# EAGLE design ModulatedIRSensor (EAGLE 6.5.0)
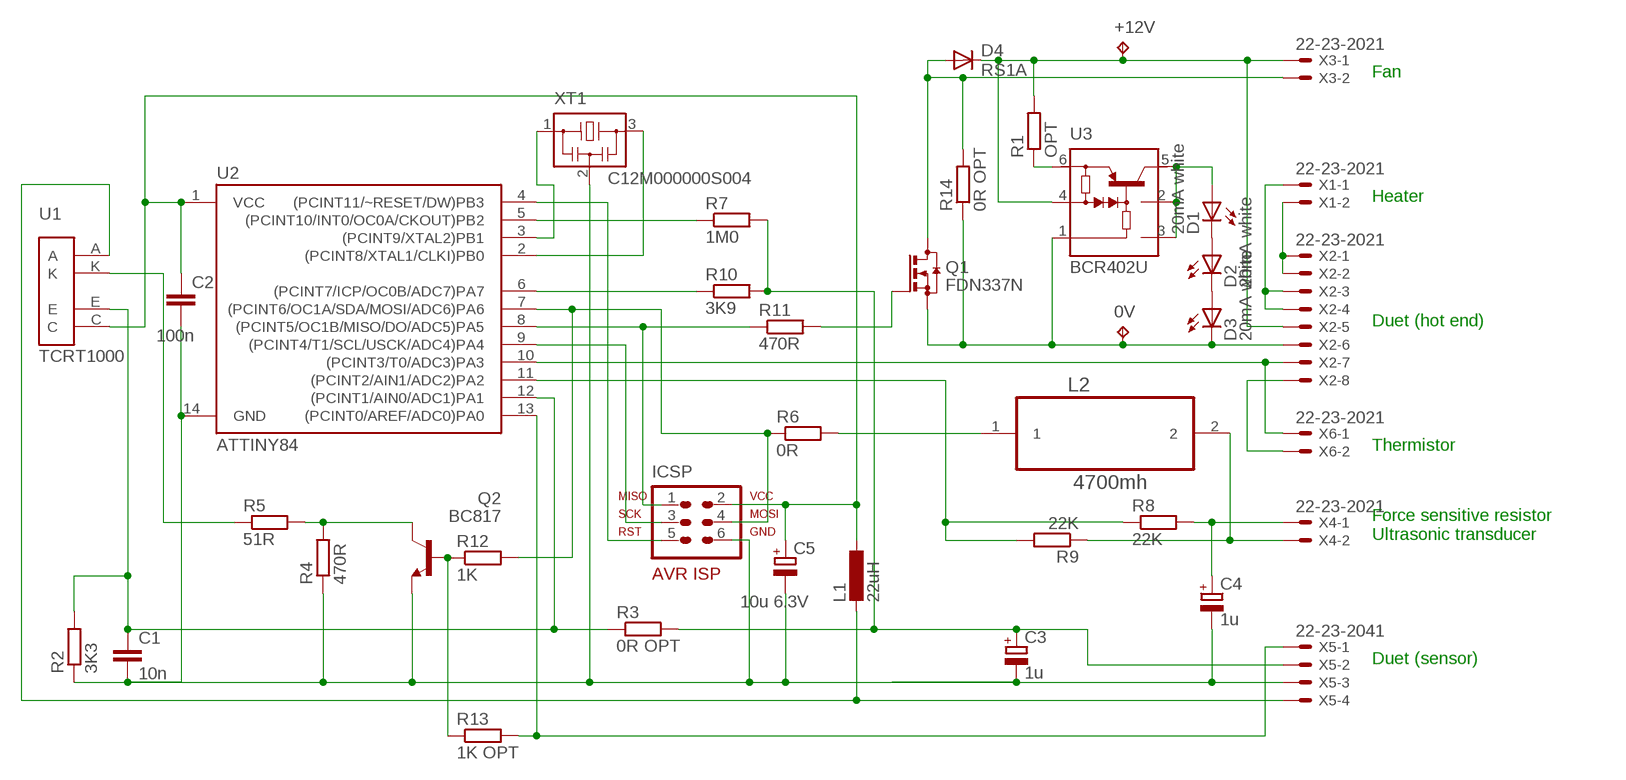
[diagram p0: schematic, sheet 1]

## Parts
0V  TPPAD1-13  [P1-13]
+12V  TPPAD1-13  [P1-13]
C1  10n  C-EUC0603  [C0603]
C2  100n  C-EUC0603  [C0603]
C3  1u  CPOL-EUSMCA  [SMC_A]
C4  1u  CPOL-EUSMCA  [SMC_A]
C5  10u 6.3V  CPOL-EUSMCA  [SMC_A]
D1  20mA white  LED5MM  [LED5MM]
D2  20mA white  LED5MM  [LED5MM]
D3  20mA white  LED5MM  [LED5MM]
D4  RS1A  DIODE-DO214AC  [DO214AC]
ICSP  AVR-ISP-6VERT  [AVR-ISP-6]
L1  22uH  L-EUL2012C  [L2012C]
L2  4700mh  B82442H1475K  [INDC5650X530N]
Q1  FDN337N  BSS123  [SOT23]
Q2  BC817  BC847  [SOT23]
R1  OPT  R-EU_R0603  [R0603]
R2  3K3  R-EU_R0603  [R0603]
R3  0R OPT  R-EU_R0603  [R0603]
R4  470R  R-EU_R0603  [R0603]
R5  51R  R-EU_R0603  [R0603]
R6  0R  R-EU_R0603  [R0603]
R7  1M0  R-EU_R0603  [R0603]
R8  22K  R-EU_R0603  [R0603]
R9  22K  R-EU_R0603  [R0603]
R10  3K9  R-EU_R0603  [R0603]
R11  470R  R-EU_R0603  [R0603]
R12  1K  R-EU_R0603  [R0603]
R13  1K OPT  R-EU_R0603  [R0603]
R14  0R OPT  R-EU_R0603  [R0603]
U1  TCRT1000  [TCRT1000]
U2  ATTINY84  [SO14]
U3  BCR402U  [SC74_INFINEON]
X1  22-23-2021  [22-23-2021]
X2  22-23-2021  22-23-2081  [22-23-2081]
X3  22-23-2021  [22-23-2021]
X4  22-23-2021  [22-23-2021]
X5  22-23-2041  [22-23-2041]
X6  22-23-2021  [22-23-2021]
XT1  C12M000000S004  CSTCR6M00G53Z  [CSTCR6M]

## Nets
GND: C1.2 C2.2 C3.- C4.- C5.- ICSP.6 Q2.2(E) R2.1 R4.1 U2.14(GND) X5.3 XT1.2
GND2: 0V.TP D3.K(C) Q1.2(S) R14.1 U3.1(GND) X2.6
LED: D1.A U3.2(IOUT2) U3.3(IOUT3) U3.5(IOUT1)
N$1: L1.2 U1.A X5.4
N$2: L2.2 R9.1 X4.2
N$3: ICSP.5 U2.4((PCINT11/~RESET/DW)PB3)
N$4: ICSP.1 R11.1 U2.8((PCINT5/OC1B/MISO/DO/ADC5)PA5)
N$5: ICSP.3 U2.9((PCINT4/T1/SCL/USCK/ADC4)PA4)
N$6: ICSP.4 R6.1 R12.2 U2.7((PCINT6/OC1A/SDA/MOSI/ADC6)PA6)
N$7: R1.1 U3.6(REXT)
N$8: D1.K(C) D2.A
N$9: U2.10((PCINT3/T0/ADC3)PA3) X2.7 X6.1
N$10: X1.2 X2.1 X2.2
N$11: D2.K(C) D3.A
N$13: C3.+ R3.2 R7.2 R10.2 X5.2
N$14: D4.A Q1.3(D) R14.2 X3.2
N$15: X1.1 X2.3 X2.4
N$16: X2.8 X6.2
N$17: R5.1 U1.K
N$18: L2.1 R6.2
N$19: Q2.3(C) R4.2 R5.2
N$20: R7.1 U2.5((PCINT10/INT0/OC0A/CKOUT)PB2)
N$21: C4.+ R8.2 X4.1
N$22: R10.1 U2.6((PCINT7/ICP/OC0B/ADC7)PA7)
N$24: R8.1 R9.2 U2.11((PCINT2/AIN1/ADC2)PA2)
N$25: Q1.1(G) R11.2
N$26: Q2.1(B) R12.1 R13.1
N$27: C1.1 R2.2 R3.1 U1.E U2.12((PCINT1/AIN0/ADC1)PA1)
N$28: R13.2 U2.13((PCINT0/AREF/ADC0)PA0) X5.1
N$31: U2.2((PCINT8/XTAL1/CLKI)PB0) XT1.3
N$32: U2.3((PCINT9/XTAL2)PB1) XT1.1
VCC: C2.1 C5.+ ICSP.2 L1.1 U1.C U2.1(VCC)
VS+12V: +12V.TP D4.C R1.2 U3.4(VIN) X2.5 X3.1

## Notes on the sheet
- Fan
- Heater
- U1
- Duet (hot end)
- TCRT1000
- Thermistor
- Force sensitive resistor
  Ultrasonic transducer
- Duet (sensor)

## Library data of the parts
0V +12V = testpad:TP: Test pad
C1 C2 = resistor:C-EU: CAPACITOR, European symbol
C3 C4 = resistor:CPOL-EU: POLARIZED CAPACITOR, European symbol
C5 = rcl:CPOL-EU: POLARIZED CAPACITOR, European symbol
D1-D3 = led:LED: LED OSRAM: - CHIPLED LG R971, LG N971, LY N971, LG Q971, LY Q971, LO R971, LY R971 LH N974, LH R974 LS Q976, LO Q976, LY Q976 LO Q996 - Hyper CHIPLED LW Q18S LB Q993, LB Q99A, LB R99A - SideLED LS A670, LO A670, LY A670, LG A670, LP A670 LB A673, LV A673, LT A673, LW A673 LH A674 LY A675 LS A676, LA A676, LO A676, LY A676, LW A676 LS A679, LY A679, LG A679 - Hyper Micro SIDELED® LS Y876, LA Y876, LO Y876, LY Y876 LT Y87S - SmartLED LW L88C, LW L88S LB L89C, LB L89S, LG L890 LS L89K, LO L89K, LY L89K LS L896, LA L896, LO L896, LY L896 - TOPLED LS T670, LO T670, LY T670, LG T670, LP T670 LSG T670, LSP T670, LSY T670, LOP T670, LYG T670 LG T671, LOG T671, LSG T671 LB T673, LV T673, LT T673, LW T673 LH T674 LS T676, LA T676, LO T676, LY T676, LB T676, LH T676, LSB T676, LW T676 LB T67C, LV T67C, LT T67C, LS T67K, LO T67K, LY T67K, LW E67C LS E67B, LA E67B, LO E67B, LY E67B, LB E67C, LV E67C, LT E67C LW T67C LS T679, LY T679, LG T679 LS T770, LO T770, LY T770, LG T770, LP T770 LB T773, LV T773, LT T773, LW T773 LH T774 LS E675, LA E675, LY E675, LS T675 LS T776, LA T776, LO T776, LY T776, LB T776 LHGB T686 LT T68C, LB T68C - Hyper Mini TOPLED® LB M676 - Mini TOPLED Santana® LG M470 LS M47K, LO M47K, LY M47K Source: http://www.osram.convergy.de LUXEON: - LUMILED® LXK2-PW12-R00, LXK2-PW12-S00, LXK2-PW14-U00, LXK2-PW14-V00 LXK2-PM12-R00, LXK2-PM12-S00, LXK2-PM14-U00 LXK2-PE12-Q00, LXK2-PE12-R00, LXK2-PE12-S00, LXK2-PE14-T00, LXK2-PE14-U00 LXK2-PB12-K00, LXK2-PB12-L00, LXK2-PB12-M00, LXK2-PB14-N00, LXK2-PB14-P00, LXK2-PB14-Q00 LXK2-PR12-L00, LXK2-PR12-M00, LXK2-PR14-Q00, LXK2-PR14-R00 LXK2-PD12-Q00, LXK2-PD12-R00, LXK2-PD12-S00 LXK2-PH12-R00, LXK2-PH12-S00 LXK2-PL12-P00, LXK2-PL12-Q00, LXK2-PL12-R00 Source: www.luxeon.com KINGBRIGHT: KA-3528ASYC Source: www.kingbright.com
D4 = diode:DIODE-: DIODE
ICSP = avr-7:AVR-ISP-6: AVR ISP-6 Serial Programming Header
L1 = rcl:L-EU: INDUCTOR, European symbol
L2 = Epcos_By_element14_Batch_1:B82442H1475K: SMT inductors; MPN: B82442H1475K; OC_FARNELL: 3877474; OC_NEWARK: 13J5641; SUPPLIER: EPCOS; TOLERANCE: ±10%
Q1 = transistor-small-signal:BSS123: N-CHANNEL MOS FET
Q2 = transistor:BC847: NPN TRANSISTOR
R1-R14 = resistor:R-EU_: RESISTOR, European symbol
U1 = eschertechnologies:TCRT1000: Vishay TCRT1000 reflective optical sensor
U2 = SparkFun-DigitalIC:ATTINY84: Atmel 14-pin 2/4/8kB flash uC
U3 = digital-transistors-1:BCR402: Current Source 18V(R) / 40V(U), typ. 20mA, max 60mA
X1 X3 X4 X6 = con-molex:22-23-2021: .100" (2.54mm) Center Header - 2 Pin; MF: MOLEX; MPN: 22-23-2021; OC_FARNELL: 1462926; OC_NEWARK: 25C3832
X2 = con-molex:22-23-2081: .100" (2.54mm) Center Header - 8 Pin; MF: MOLEX; MPN: 22-23-2081; OC_FARNELL: 1756826; OC_NEWARK: 01C7592
X5 = con-molex:22-23-2041: .100" (2.54mm) Center Header - 4 Pin; MF: MOLEX; MPN: 22-23-2041; OC_FARNELL: 1462920; OC_NEWARK: 38C0355
XT1 = murata-filter:CSTCR: Resonator Source: murata.co.jp; MPN: CSTCR6M00G53-R0; OC_FARNELL: 1170434; OC_NEWARK: 25M8759

## Board
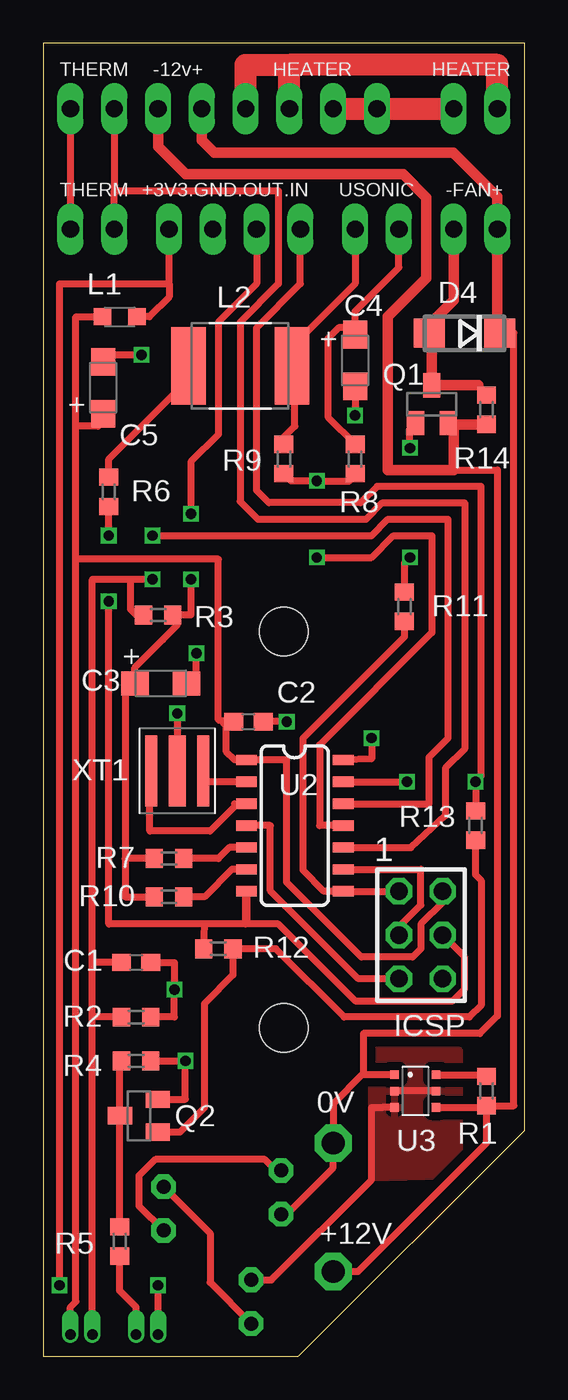
[diagram p1: board, top side]
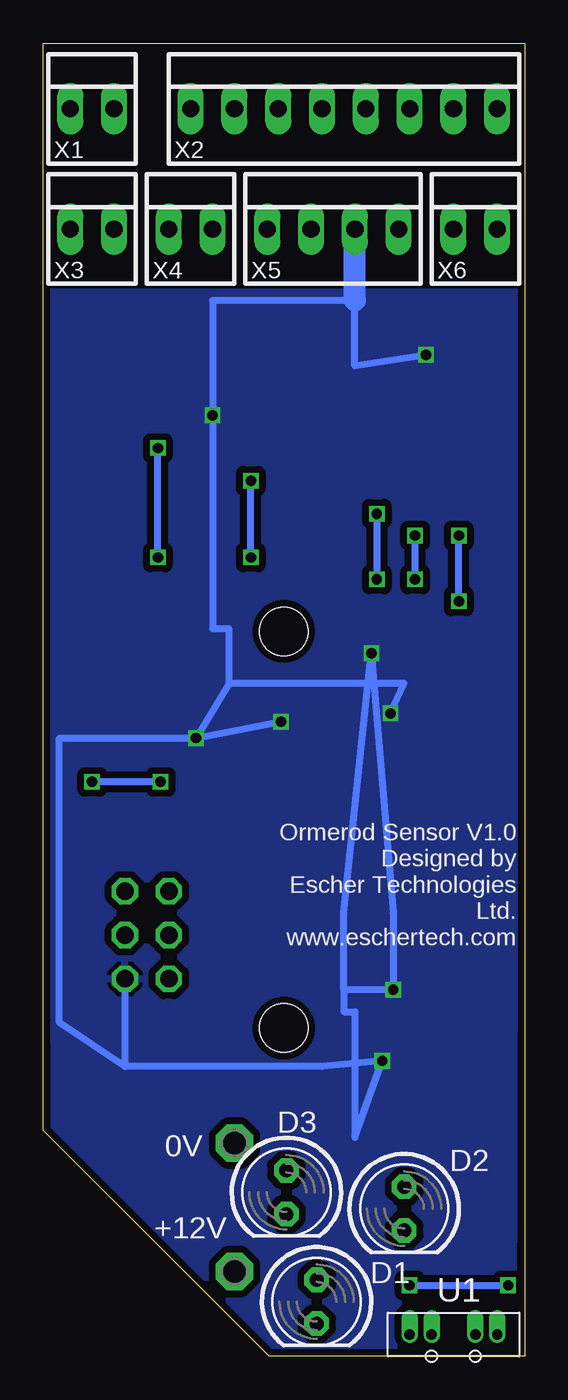
[diagram p2: board, bottom side, seen from below]

Size 27.93 x 76.19 mm. Coordinates in mm from the lower left corner, seen from the top.
Outline: 0,0 14.81,0 27.93,13.12 27.93,76.19 0,76.19 0,0
Copper layers (1*16): Top 0.035mm / dielectric 1.5mm / Bottom 0.035mm
Design rules "ITEADstudio_DRC-8mil": minimum track width 6mil, minimum drill 12mil, track to track 6mil, track to pad 6mil, pad to pad 6mil, via to via 6mil, smd to smd 0mil, copper to edge 10mil, drill to drill 10mil, minimum pad ring 7mil, minimum via ring 6mil, stop-mask expansion 2mil, vias tented up to drill 100mil, thermal gap 10mil
Holes 2.8 mm at 13.97,19.05 13.97,42.07

### Footprints (pad centres in the part's own frame; a part is rotated, then mirrored left to right if it is on the bottom)
P1-13 = drill 1.321 pad 2.159 octagon: TP 0,0
C0603 = smd 1.1 x 1: 1 -0.85,0; 2 0.85,0
SMC_A = smd 1.6 x 1.4: + -1.5,0; - 1.5,0
LED5MM = drill 0.813 pad 1.422 octagon: A -1.27,0; K 1.27,0
DO214AC = smd 1.8 x 1.7: A 2.05,0; C -2.05,0
AVR-ISP-6 = drill 1.016 octagon: 1 -2.54,-1.27; 2 -2.54,1.27; 3 0,-1.27; 4 0,1.27; 5 2.54,-1.27; 6 2.54,1.27
L2012C = smd 1 x 1: 1 -1,0; 2 1,0
INDC5650X530N = smd 2.007 x 4.496: 1 -2.997,0; 2 2.997,0
SOT23 = smd 1 x 1.4: 1 -0.95,-1.1; 2 0.95,-1.1; 3 0,1.1
R0603 = smd 1 x 1.1: 1 -0.85,0; 2 0.85,0
TCRT1000 = drill 0.6 pad 0.813 offset: A -2.54,0; C 2.54,0; E 1.27,0; K -1.27,0
SO14 = smd 0.6 x 1.2: 1 -3.81,-2.8; 2 -2.54,-2.8; 3 -1.27,-2.8; 4 0,-2.8; 5 1.27,-2.8; 6 2.54,-2.8; 7 3.81,-2.8; 8 3.81,2.8; 9 2.54,2.8; 10 1.27,2.8; 11 0,2.8; 12 -1.27,2.8; 13 -2.54,2.8; 14 -3.81,2.8
SC74_INFINEON = smd 0.5 x 0.5: 1 -0.95,-1.2; 2 0,-1.2; 3 0.95,-1.2; 4 0.95,1.2; 5 0,1.2; 6 -0.95,1.2
22-23-2021 = drill 1 long: 1 -1.27,0; 2 1.27,0
22-23-2081 = drill 1 long: 1 -8.89,0; 2 -6.35,0; 3 -3.81,0; 4 -1.27,0; 5 1.27,0; 6 3.81,0; 7 6.35,0; 8 8.89,0
22-23-2041 = drill 1 long: 1 -3.81,0; 2 -1.27,0; 3 1.27,0; 4 3.81,0
CSTCR6M = smd 0.7 x 4.1: 1 -1.5,0; 3 1.5,0 | smd 1 x 4.1: 2 0,0

### Placement (x,y rotation side)
0V  16.83,12.38 0 bottom
+12V  16.83,4.92 0 bottom
C1  5.4,22.86 0 top
C2  11.91,36.83 0 top
C3  6.83,39.05 0 top
C4  18.1,57.78 270 top
C5  3.49,56.2 90 top
D1  12.06,3.17 270 bottom
D2  6.99,8.57 270 bottom
D3  13.81,9.53 270 bottom
D4  24.45,59.37 180 top
ICSP  21.91,24.45 270 top
L1  4.45,60.33 0 top
L2  11.43,57.47 0 top
Q1  22.54,55.24 0 top
Q2  5.56,13.97 90 top
R1  25.72,15.4 270 top
R2  5.4,19.68 180 top
R3  6.67,43.02 0 top
R4  5.4,17.14 180 top
R5  4.45,6.67 90 top
R6  3.81,50.16 90 top
R7  7.3,28.89 180 top
R8  18.1,52.07 90 top
R9  13.97,52.07 270 top
R10  7.3,26.67 180 top
R11  20.95,43.5 90 top
R12  10.16,23.65 180 top
R13  25.08,30.8 90 top
R14  25.72,54.93 90 top
U1  4.13,1.27 0 bottom
U2  14.61,30.8 270 top
U3  21.59,15.4 270 top
X1  25.08,72.39 0 bottom
X2  10.48,72.39 0 bottom
X3  25.08,65.41 0 bottom
X4  19.37,65.41 0 bottom
X5  11.11,65.41 0 bottom
X6  2.86,65.41 0 bottom
XT1  7.78,33.97 0 top

### Tracks (layer width: path | path; a pad name or v marks a point on that pad's centre or on a via)
GND  (via drill 0.6)
  Top 0.406: R4.1 v8.26,17.14 8.26,14.92 Q2.2 | R2.1 7.62,19.68 v7.62,21.27 7.62,22.86 C1.2 | v19.05,35.88 19.05,34.66 U2.14 | C4.- v18.1,54.61 | v5.71,58.1 3.49,58.1 C5.- | v7.78,37.31 XT1.2 | v14.13,36.83 C2.2 | C3.- 8.89,39.05 v8.89,40.8
  Bottom 0.406: v19.05,35.88 v14.13,36.83 | 17.14,39.05 17.14,42.23 18.1,42.23 v18.1,54.61 18.1,61.28 9.84,61.28 9.84,57.47 v5.71,58.1 | 23.18,16.83 11.75,16.83 v8.26,17.14 9.84,12.7 9.84,20 10.48,20 10.48,21.27 | ICSP.6 23.18,16.83 | 23.18,16.83 26.99,19.37 26.99,35.88 v19.05,35.88 | v7.78,37.31 6.99,39.05 17.14,39.05 | 17.14,39.05 v19.05,35.88 | 10.48,21.27 v7.62,21.27 7.62,25.72 v8.89,40.8 10.48,25.72 10.48,21.27
  Bottom 1.27: 9.84,61.28 X5.3
  pour Bottom (isolate 0.406): 0.48,61.75 27.46,61.75 27.3,13.32 14.46,0.48 0.64,0.48
GND2
  Top 0.406: 23.81,51.44 26.35,51.44 26.35,19.75 25.34,18.73 18.57,18.73 18.57,16.35 | 23.81,54.15 Q1.2 23.56,54.08 | 18.57,16.35 18.52,16.35 16.83,14.66 0V.TP 16.83,10.95 14.13,8.26 D3.K | 18.57,16.35 U3.1
  Top 0.61: X2.6 6.67,70.2 8.29,68.58 20.88,68.58 22.23,67.23 22.23,62.55 20,60.33 20,51.44 23.81,51.44 23.81,54.15 | R14.1 23.56,54.08
LED
  Top 0.406: D1.A 13.24,4.45 19.05,10.26 19.05,14.45 19.68,14.45 19.69,14.45 U3.3 | U3.5 U3.2
  pour Top (isolate 0.5): 19.05,10.32 19.05,17.78 24.13,17.78 24.13,12.48 24.19,10.48
N$1  (via drill 0.6)
  Top 0.406: v0.95,4.13 0.95,62.23 7.3,62.23 | 7.3,62.23 X5.4 | 7.3,62.23 7.3,61.47 6.16,60.33 L1.2 | U1.A v6.67,4.13
  Bottom 0.406: v6.67,4.13 v0.95,4.13
N$2
  Top 0.406: X4.2 18.1,62.23 14.29,58.42 14.29,57.61 L2.2 14.92,56.97 14.92,56.52 14.61,56.2 14.61,53.98 13.97,53.34 R9.1
N$3
  Top 0.406: ICSP.5 18.29,21.91 13.18,27.02 13.18,30.8 U2.4
N$4
  Top 0.406: R11.1 20.95,41.75 15.08,35.88 15.08,28.2 16.29,26.99 U2.8 ICSP.1
N$5
  Top 0.406: ICSP.3 20.64,24.92 21.91,26.19 21.91,28.26 U2.9
N$6  (via drill 0.6)
  Top 0.406: 11.8,25.14 U2.7 11.75,26.93 11.75,25.08 | 11.75,25.08 9.37,25.08 | 9.37,25.08 3.81,25.08 v3.81,43.81 | v3.81,47.62 R6.1 | R12.2 9.37,25.08 | ICSP.4 24.45,23.18 24.45,21.31 23.77,20.64 18.1,20.64 13.65,25.08 11.75,25.08
  Bottom 0.406: v3.81,43.81 v3.81,47.62
N$7
  Top 0.406: U3.6 25.62,16.35 R1.1
N$8
  Top 0.406: D2.A 9.68,7.14 9.68,4.29 D1.K
N$9
  Top 0.406: X2.7 4.13,67.63 | X6.1 4.13,67.63 | 4.13,67.63 13.65,67.63 13.65,62.23 11.43,60.01 11.43,49.6 12.46,48.58 18.73,48.58 19.68,49.53 24.45,49.53 24.45,35.24 23.34,34.13 23.34,31.37 21.33,29.53 U2.10
N$10
  Top 1.27: X2.2 X2.1 X1.2
N$11
  Top 0.406: D3.A 13.49,10.79 12.86,11.43 6.51,11.43 5.56,10.48 5.56,8.73 D2.K
N$13  (via drill 0.6)
  Top 0.406: X5.2 12.38,62.23 10.16,60.01 10.16,53.5 8.57,51.91 v8.57,48.9 | 4.76,28.89 4.76,39.05 C3.+ 5.33,39.97 6.95,41.59 7.78,42.42 7.78,42.76 R3.2 8.57,43.02 v8.57,45.09 | 4.76,28.89 4.76,26.67 R10.2 | R7.2 4.76,28.89
  Bottom 0.406: v8.57,48.9 v8.57,45.09
N$14
  Top 0.406: 22.54,59.05 22.86,59.37 D4.A 22.54,59.52 22.54,60.01 | 25.25,56.34 25.4,56.2 25.4,56.09 R14.2
  Top 0.61: 22.54,59.05 Q1.3 25.25,56.34 | X3.2 23.81,61.28 22.54,60.01
N$15
  Top 1.27: X1.1 26.35,74.93 14.29,74.93 | X2.3 14.29,74.93 | X2.4 11.75,74.93 14.29,74.93
N$16
  Top 0.406: X2.8 X6.2
N$17
  Top 0.406: R5.1 4.45,3.81 5.4,2.86 U1.K
N$18
  Top 0.406: 8.26,57.47 L2.1 8.57,57.33 8.57,56.83 3.81,52.07 R6.2
N$19
  Top 0.406: R5.2 4.45,13.16 Q2.3 4.46,17.05 R4.2 4.62,17.08
N$20
  Top 0.406: U2.5 10.79,29.53 10.16,28.89 R7.1
N$21
  Top 0.406: 20.64,64.45 X4.1 20.64,63.18 18.1,60.64 C4.+ 18.1,59.69 17.14,59.69 16.51,59.05 16.51,54.51 R8.2
N$22
  Top 0.406: U2.6 10.95,28.26 9.37,26.67 R10.1
N$24  (via drill 0.6)
  Top 0.406: U2.11 16.03,30.8 16.03,35.48 22.54,41.99 22.54,47.62 20.32,47.62 19.05,46.35 v15.88,46.35 | R9.2 14.39,50.8 v15.88,50.8 17.78,50.8 17.78,50.9 R8.1
  Bottom 0.406: v15.88,46.35 v15.88,50.8
N$25  (via drill 0.6)
  Top 0.406: 21.91,53.98 Q1.1 21.27,53.83 v21.27,52.7 | v21.27,46.35 20.95,46.04 R11.2
  Bottom 0.406: v21.27,46.35 v21.27,52.7
N$26
  Top 0.406: R13.1 25.08,27.94 25.4,27.62 25.4,20.36 24.73,19.68 17.46,19.68 13.49,23.65 R12.1 11.01,22.12 9.37,20.48 9.37,14.45 7.94,13.02 Q2.1
N$27  (via drill 0.6)
  Top 0.406: R2.2 2.86,19.68 | 2.86,19.68 2.86,22.86 | C1.1 2.86,22.86 | 2.86,22.86 2.86,45.09 5.08,45.09 | v6.35,47.62 19.05,47.62 20,48.58 23.5,48.58 23.5,35.88 22.38,34.77 22.38,32.07 U2.12 | v6.35,45.09 5.08,45.09 | U1.E 2.86,19.68 | R3.1 5.4,43.02 5.08,43.34 5.08,45.09
  Bottom 0.406: v6.35,45.09 v6.35,47.62
N$28  (via drill 0.6)
  Top 0.406: U2.13 v21.11,33.34 | X5.1 14.92,62.23 12.38,59.69 12.38,50.24 13.09,49.53 18.41,49.53 19.37,50.48 25.4,50.48 25.4,33.66 v25.08,33.34 R13.2
  Bottom 0.406: v21.11,33.34 v25.08,33.34
N$31
  Top 0.406: U2.2 9.21,33.34 9.21,33.9 XT1.3
N$32
  Top 0.406: U2.3 11.11,32.07 11.11,31.91 9.68,30.48 6.19,30.48 6.19,32.38 6.35,32.54 6.35,33.27 XT1.1
VCC
  Top 0.406: 1.91,46.35 1.91,3.17 1.59,2.86 U1.C | 1.91,46.35 1.91,53.98 | 1.91,53.98 1.91,60.33 L1.1 | 1.91,46.35 2.01,46.25 10.16,46.25 10.16,36.93 C2.1 | C5.+ 3.49,54.29 3.17,53.98 1.91,53.98 | ICSP.2 23.18,26.35 21.91,25.08 21.91,23.65 21.43,23.18 18.46,23.18 14.13,27.51 14.13,34.61 U2.1 11.11,34.61 10.64,35.08 10.64,36.57 10.48,36.73 C2.1 | 10.64,36.89 C2.1
VS+12V
  Top 0.406: 26.35,59.37 D4.C 27.3,59.37 27.3,14.55 R1.2 | 26,14.26 R1.2 | R1.2 25.72,12.38 18.26,4.92 +12V.TP | U3.4 25.62,14.45 R1.2
  Top 0.61: X2.5 9.21,70.56 9.92,69.85 23.79,69.85 26.35,67.29 X3.1 26.35,59.37

### Text on the board
tNames: THERM | -12v+ | HEATER | HEATER | THERM | +3V3.GND.OUT.IN | USONIC | -FAN+ | + | + | + | 1 | 0V | +12V
bNames: Ormerod Sensor V1.0 / Designed by / Escher Technologies / Ltd. / www.eschertech.com | U1